# Altium schematic sheet demo_dermis_main_testboard_inamps.SchDoc
size A0
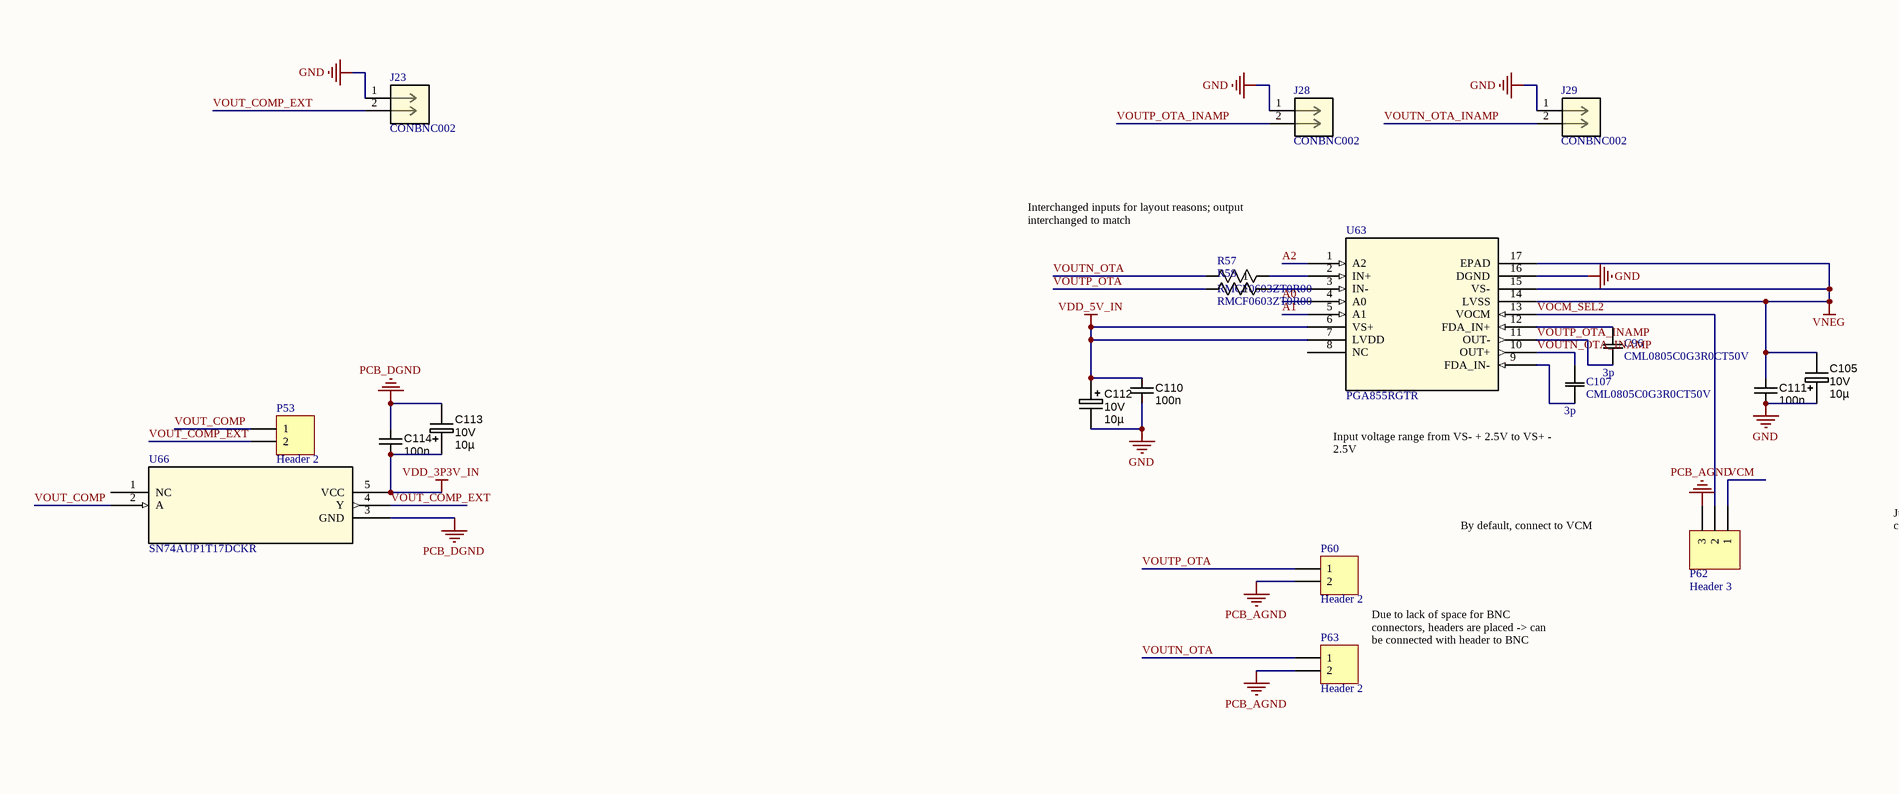
[diagram p0: demo_dermis_main_testboard_inamps.SchDoc, left]
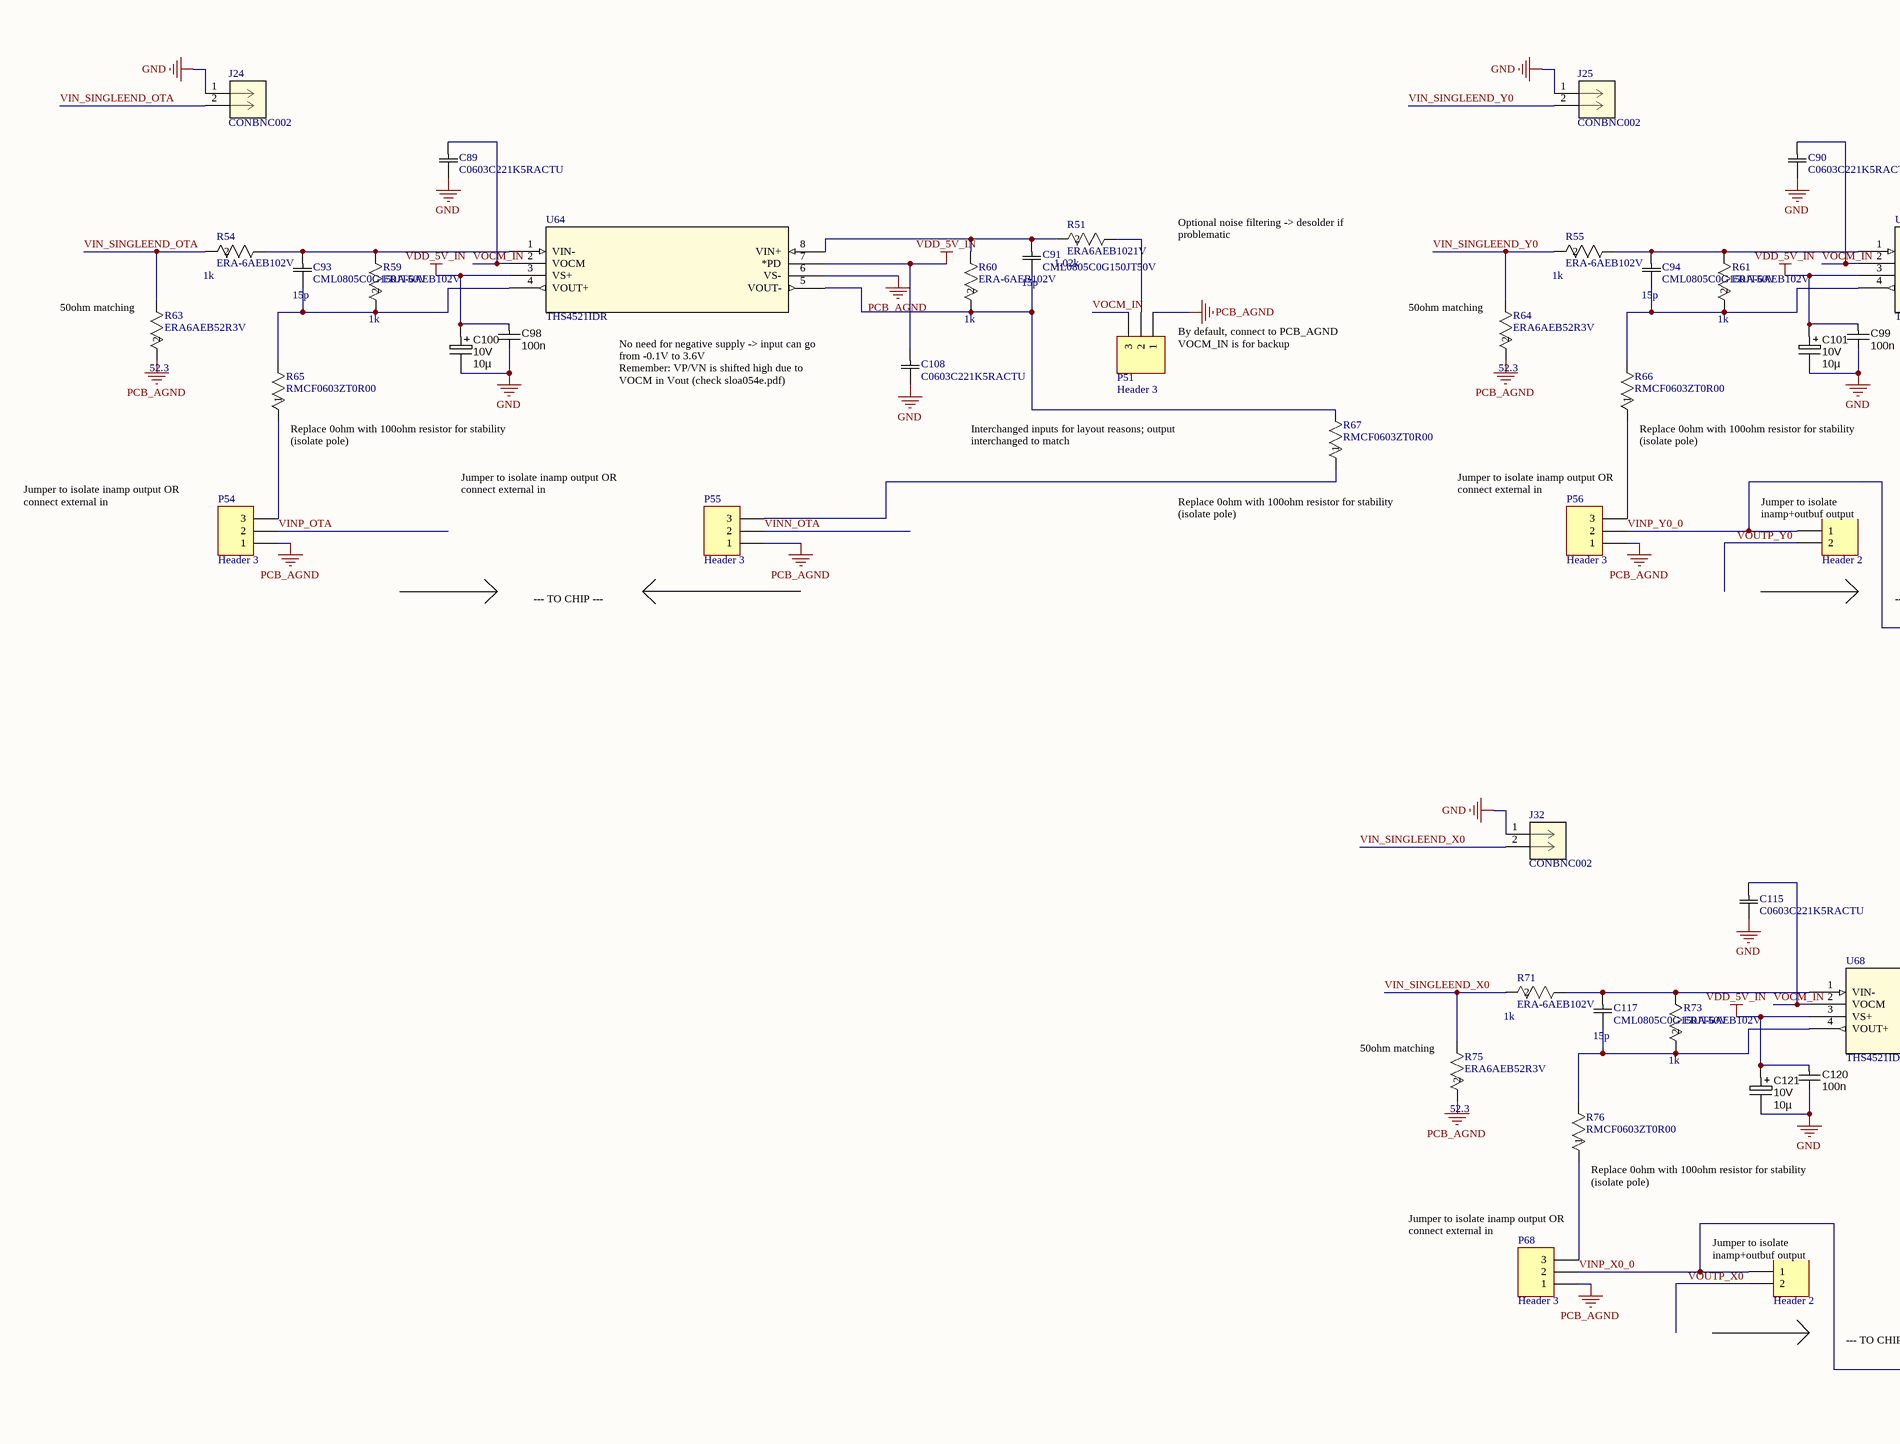
[diagram p1: demo_dermis_main_testboard_inamps.SchDoc, middle]
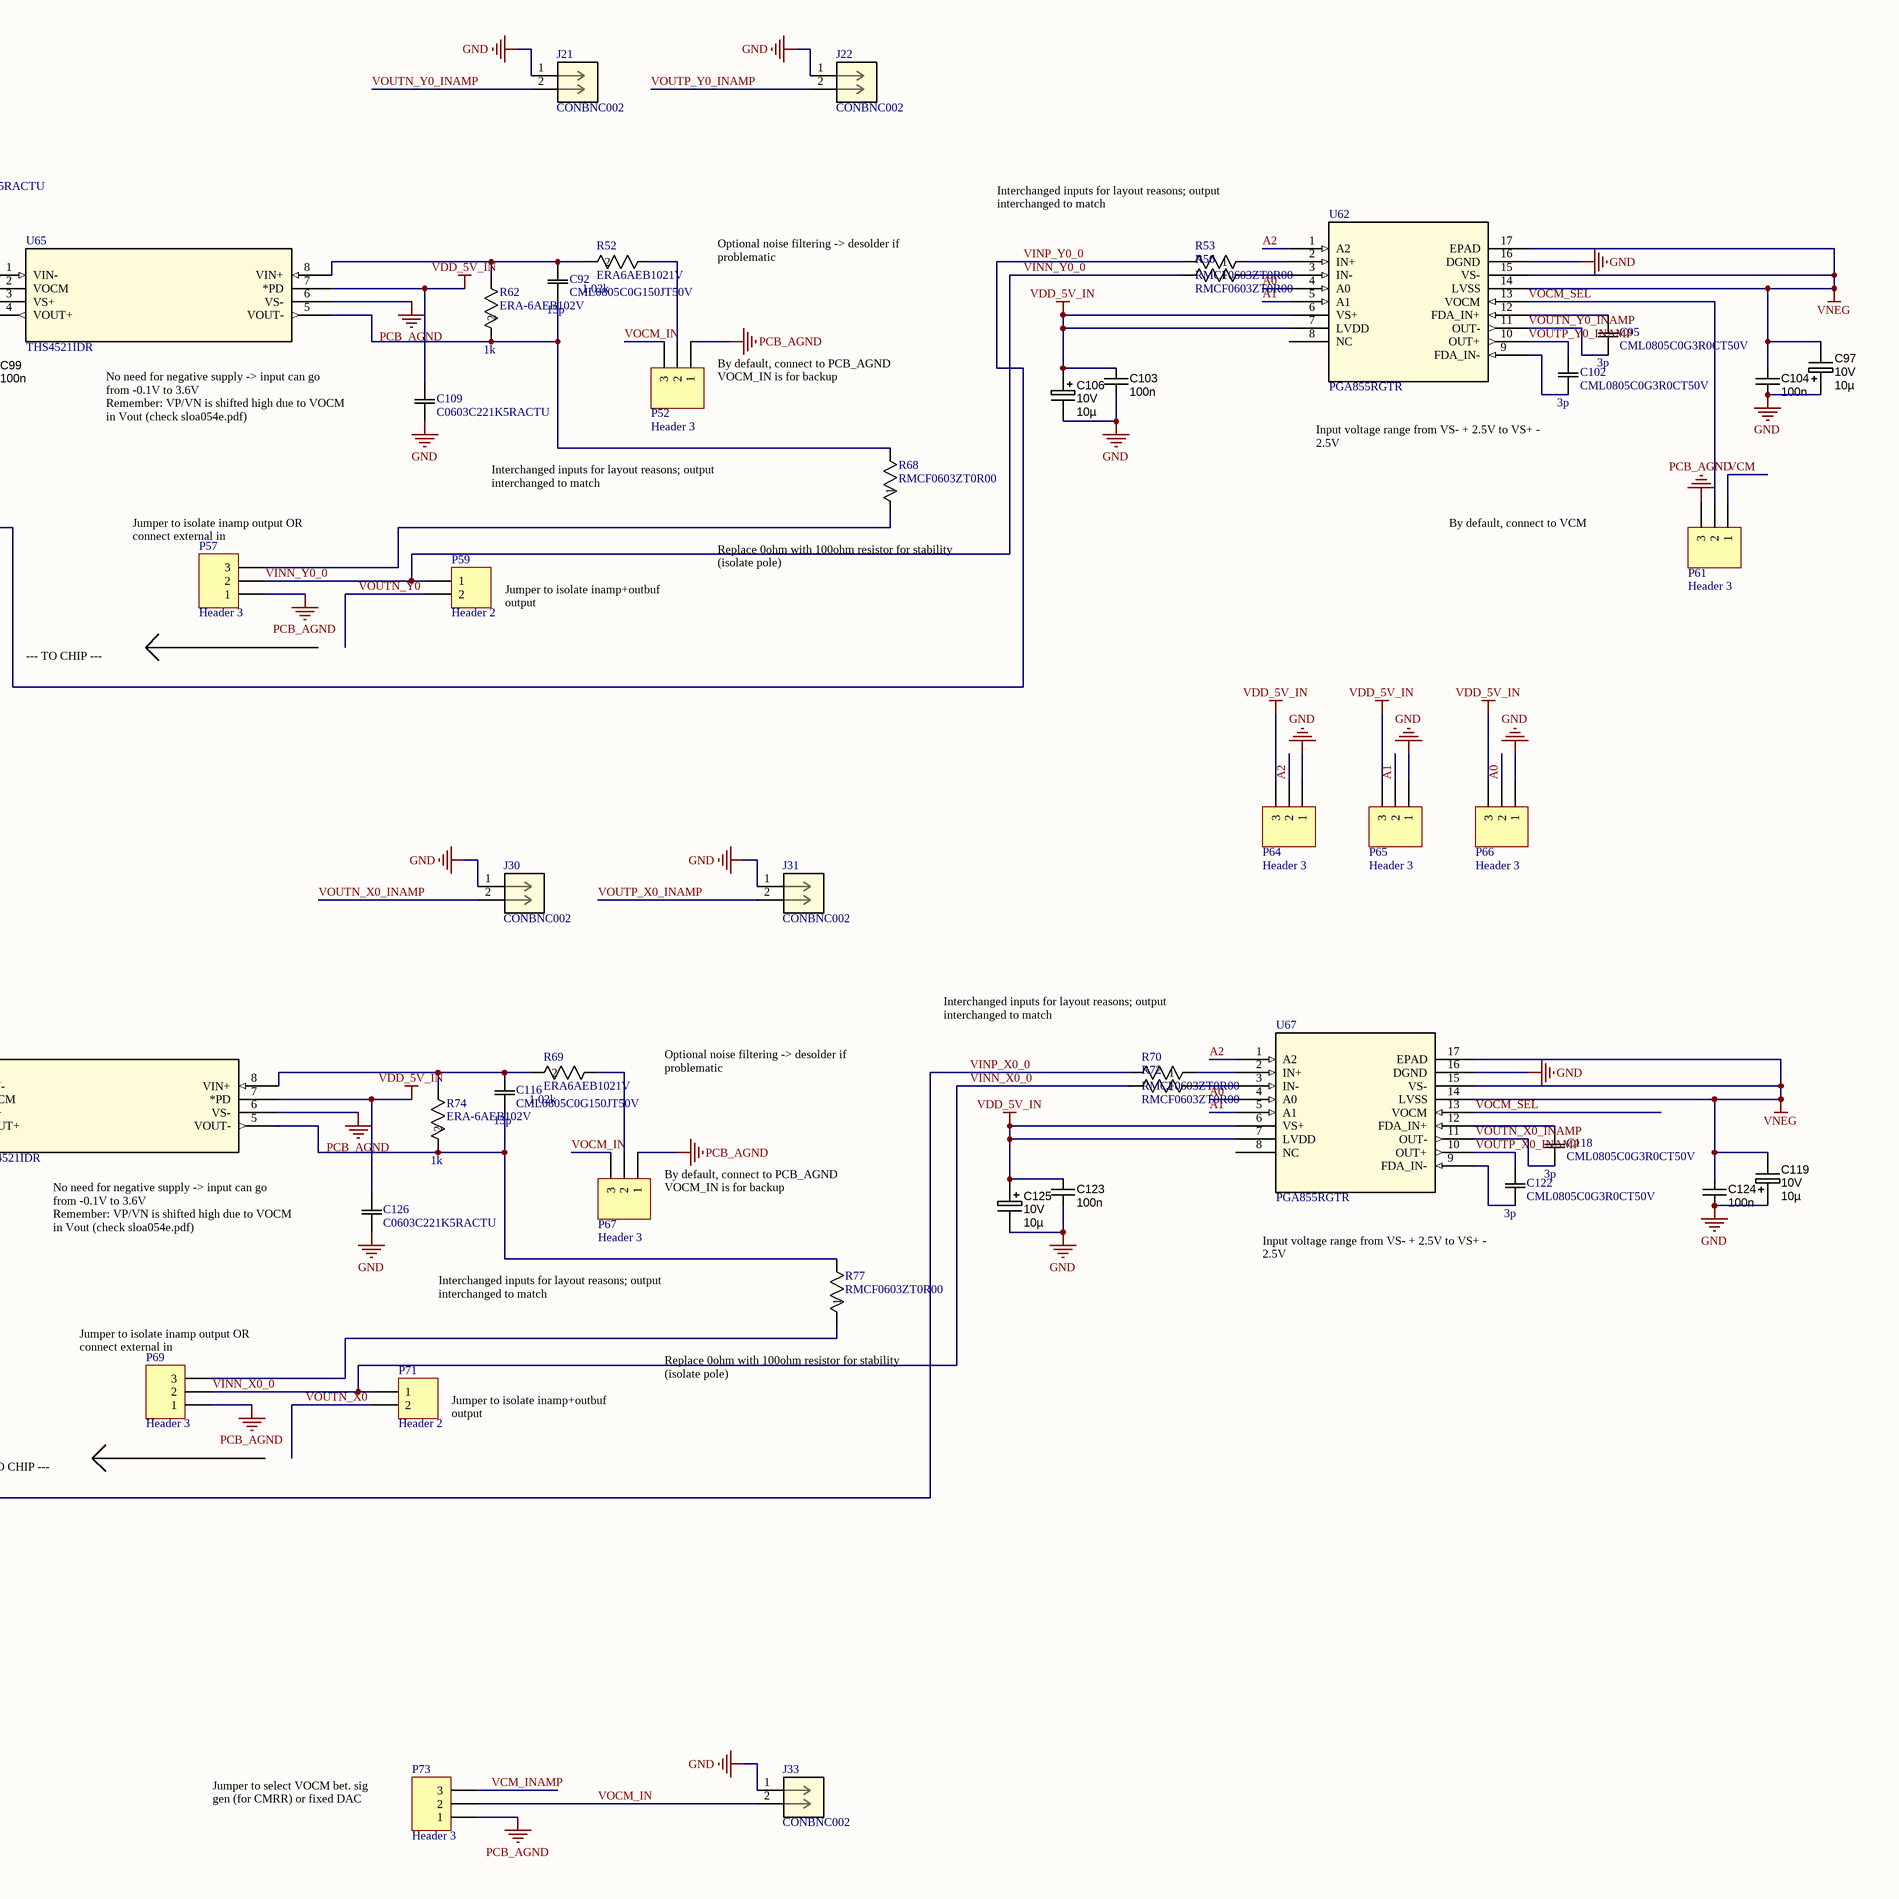
[diagram p2: demo_dermis_main_testboard_inamps.SchDoc, right]

## Parts
C89  C0603C221K5RACTU  [CAPC17595_87N_KEM]
C90  C0603C221K5RACTU  [CAPC17595_87N_KEM]
C91  CML0805C0G150JT50V  value 15p  [CAP_CML_0805_.3pF-1500pF,4700pF_STP]
C92  CML0805C0G150JT50V  value 15p  [CAP_CML_0805_.3pF-1500pF,4700pF_STP]
C93  CML0805C0G150JT50V  value 15p  [CAP_CML_0805_.3pF-1500pF,4700pF_STP]
C94  CML0805C0G150JT50V  value 15p  [CAP_CML_0805_.3pF-1500pF,4700pF_STP]
C95  CML0805C0G3R0CT50V  value 3p  [CAP_CML_0805_.3pF-1500pF,4700pF_STP]
C96  CML0805C0G3R0CT50V  value 3p  [CAP_CML_0805_.3pF-1500pF,4700pF_STP]
C97  Ratings: 10V  [CAPMP2012X150USR]  (hidden comment: 10µ)
C98  value 100n  [CAPC1608N]  (hidden comment: approved sub OK)
C99  value 100n  [CAPC1608N]  (hidden comment: approved sub OK)
C100  Ratings: 10V  [CAPMP2012X150USR]  (hidden comment: 10µ)
C101  Ratings: 10V  [CAPMP2012X150USR]  (hidden comment: 10µ)
C102  CML0805C0G3R0CT50V  value 3p  [CAP_CML_0805_.3pF-1500pF,4700pF_STP]
C103  value 100n  [CAPC1608N]  (hidden comment: approved sub OK)
C104  value 100n  [CAPC1608N]  (hidden comment: approved sub OK)
C105  Ratings: 10V  [CAPMP2012X150USR]  (hidden comment: 10µ)
C106  Ratings: 10V  [CAPMP2012X150USR]  (hidden comment: 10µ)
C107  CML0805C0G3R0CT50V  value 3p  [CAP_CML_0805_.3pF-1500pF,4700pF_STP]
C108  C0603C221K5RACTU  [CAPC17595_87N_KEM]
C109  C0603C221K5RACTU  [CAPC17595_87N_KEM]
C110  value 100n  [CAPC1608N]  (hidden comment: approved sub OK)
C111  value 100n  [CAPC1608N]  (hidden comment: approved sub OK)
C112  Ratings: 10V  [CAPMP2012X150USR]  (hidden comment: 10µ)
C113  Ratings: 10V  [CAPMP2012X150USR]  (hidden comment: 10µ)
C114  value 100n  [CAPC1608N]  (hidden comment: approved sub OK)
C115  C0603C221K5RACTU  [CAPC17595_87N_KEM]
C116  CML0805C0G150JT50V  value 15p  [CAP_CML_0805_.3pF-1500pF,4700pF_STP]
C117  CML0805C0G150JT50V  value 15p  [CAP_CML_0805_.3pF-1500pF,4700pF_STP]
C118  CML0805C0G3R0CT50V  value 3p  [CAP_CML_0805_.3pF-1500pF,4700pF_STP]
C119  Ratings: 10V  [CAPMP2012X150USR]  (hidden comment: 10µ)
C120  value 100n  [CAPC1608N]  (hidden comment: approved sub OK)
C121  Ratings: 10V  [CAPMP2012X150USR]  (hidden comment: 10µ)
C122  CML0805C0G3R0CT50V  value 3p  [CAP_CML_0805_.3pF-1500pF,4700pF_STP]
C123  value 100n  [CAPC1608N]  (hidden comment: approved sub OK)
C124  value 100n  [CAPC1608N]  (hidden comment: approved sub OK)
C125  Ratings: 10V  [CAPMP2012X150USR]  (hidden comment: 10µ)
C126  C0603C221K5RACTU  [CAPC17595_87N_KEM]
J21  CONBNC002  [CONN_CONBN_LNX]
J22  CONBNC002  [CONN_CONBN_LNX]
J23  CONBNC002  [CONN_CONBN_LNX]
J24  CONBNC002  [CONN_CONBN_LNX]
J25  CONBNC002  [CONN_CONBN_LNX]
J28  CONBNC002  [CONN_CONBN_LNX]
J29  CONBNC002  [CONN_CONBN_LNX]
J30  CONBNC002  [CONN_CONBN_LNX]
J31  CONBNC002  [CONN_CONBN_LNX]
J32  CONBNC002  [CONN_CONBN_LNX]
J33  CONBNC002  [CONN_CONBN_LNX]
P51  Header 3  [HDR1X3]
P52  Header 3  [HDR1X3]
P53  Header 2  [HDR1X2]
P54  Header 3  [HDR1X3]
P55  Header 3  [HDR1X3]
P56  Header 3  [HDR1X3]
P57  Header 3  [HDR1X3]
P58  Header 2  [HDR1X2]
P59  Header 2  [HDR1X2]
P60  Header 2  [HDR1X2]
P61  Header 3  [HDR1X3]
P62  Header 3  [HDR1X3]
P63  Header 2  [HDR1X2]
P64  Header 3  [HDR1X3]
P65  Header 3  [HDR1X3]
P66  Header 3  [HDR1X3]
P67  Header 3  [HDR1X3]
P68  Header 3  [HDR1X3]
P69  Header 3  [HDR1X3]
P70  Header 2  [HDR1X2]
P71  Header 2  [HDR1X2]
P73  Header 3  [HDR1X3]
R51  ERA6AEB1021V  value 1.02k  [RES_ERA6A_0805_PAN]
R52  ERA6AEB1021V  value 1.02k  [RES_ERA6A_0805_PAN]
R53  RMCF0603ZT0R00  [STA_RMCF0603_STP]
R54  ERA-6AEB102V  value 1k  [RC0805N_PAN]
R55  ERA-6AEB102V  value 1k  [RC0805N_PAN]
R56  RMCF0603ZT0R00  [STA_RMCF0603_STP]
R57  RMCF0603ZT0R00  [STA_RMCF0603_STP]
R58  RMCF0603ZT0R00  [STA_RMCF0603_STP]
R59  ERA-6AEB102V  value 1k  [RC0805N_PAN]
R60  ERA-6AEB102V  value 1k  [RC0805N_PAN]
R61  ERA-6AEB102V  value 1k  [RC0805N_PAN]
R62  ERA-6AEB102V  value 1k  [RC0805N_PAN]
R63  ERA6AEB52R3V  value 52.3  [RES_ERA6A_0805_PAN]
R64  ERA6AEB52R3V  value 52.3  [RES_ERA6A_0805_PAN]
R65  RMCF0603ZT0R00  [STA_RMCF0603_STP]
R66  RMCF0603ZT0R00  [STA_RMCF0603_STP]
R67  RMCF0603ZT0R00  [STA_RMCF0603_STP]
R68  RMCF0603ZT0R00  [STA_RMCF0603_STP]
R69  ERA6AEB1021V  value 1.02k  [RES_ERA6A_0805_PAN]
R70  RMCF0603ZT0R00  [STA_RMCF0603_STP]
R71  ERA-6AEB102V  value 1k  [RC0805N_PAN]
R72  RMCF0603ZT0R00  [STA_RMCF0603_STP]
R73  ERA-6AEB102V  value 1k  [RC0805N_PAN]
R74  ERA-6AEB102V  value 1k  [RC0805N_PAN]
R75  ERA6AEB52R3V  value 52.3  [RES_ERA6A_0805_PAN]
R76  RMCF0603ZT0R00  [STA_RMCF0603_STP]
R77  RMCF0603ZT0R00  [STA_RMCF0603_STP]
U62  PGA855RGTR  [VQFN16_RGT_TEX]
U63  PGA855RGTR  [VQFN16_RGT_TEX]
U64  THS4521IDR  [D8]
U65  THS4521IDR  [D8]
U66  SN74AUP1T17DCKR  [DCK5]
U67  PGA855RGTR  [VQFN16_RGT_TEX]
U68  THS4521IDR  [D8]

## Nets
GND: C89.2 C90.2 C97.1 C98.2 C99.2 C100.2 C101.2 C103.2 C104.1 C105.1 C106.2 C108.2 C109.2 C110.2 C111.1 C112.2 C115.2 C119.1 C120.2 C121.2 C123.2 C124.1 C125.2 C126.2 J21.1 J22.1 J23.1 J24.1 J25.1 J28.1 J29.1 J30.1 J31.1 J32.1 J33.1 P64.1 P65.1 P66.1 U62.16(DGND) U63.16(DGND) U67.16(DGND)
PCB_AGND: P51.1 P52.1 P54.1 P55.1 P56.1 P57.1 P60.2 P61.3 P62.3 P63.2 P67.1 P68.1 P69.1 P73.1 R63.2 R64.2 R75.2 U64.6(VS-) U65.6(VS-) U68.6(VS-)
PCB_DGND: C113.2 C114.2 U66.3(GND)
VDD_3P3V_IN: C113.1 C114.1 U66.5(VCC)
VDD_5V_IN: C98.1 C99.1 C100.1 C101.1 C103.1 C106.1 C108.1 C109.1 C110.1 C112.1 C120.1 C121.1 C123.1 C125.1 C126.1 P64.3 P65.3 P66.3 U62.6(VS+) U62.7(LVDD) U63.6(VS+) U63.7(LVDD) U64.3(VS+) U64.7(*PD) U65.3(VS+) U65.7(*PD) U67.6(VS+) U67.7(LVDD) U68.3(VS+) U68.7(*PD)
VNEG: C97.2 C104.2 C105.2 C111.2 C119.2 C124.2 U62.14(LVSS) U62.15(VS-) U62.17(EPAD) U63.14(LVSS) U63.15(VS-) U63.17(EPAD) U67.14(LVSS) U67.15(VS-) U67.17(EPAD)
A0: P66.2 U62.4(A0) U63.4(A0) U67.4(A0)
A1: P65.2 U62.5(A1) U63.5(A1) U67.5(A1)
A2: P64.2 U62.1(A2) U63.1(A2) U67.1(A2)
VCM: P61.1 P62.1
VCM_INAMP: P73.3
VIN_SINGLEEND_OTA: J24.2 R54.2 R63.1
VIN_SINGLEEND_X0: J32.2 R71.2 R75.1
VIN_SINGLEEND_Y0: J25.2 R55.2 R64.1
VINN_OTA: P55.2
VINN_X0_0: P69.2 P71.1 R72.2
VINN_Y0_0: P57.2 P59.1 R56.2
VINP_OTA: P54.2
VINP_X0_0: P68.2 P70.1 R70.2
VINP_Y0_0: P56.2 P58.1 R53.2
VOCM_IN: C89.1 C90.1 C115.1 J33.2 P51.3 P52.3 P67.3 P73.2 U64.2(VOCM) U65.2(VOCM) U68.2(VOCM)
VOCM_SEL: P61.2 U62.13(VOCM) U67.13(VOCM)
VOCM_SEL2: P62.2 U63.13(VOCM)
VOUT_COMP: P53.1 U66.2(A)
VOUT_COMP_EXT: J23.2 P53.2 U66.4(Y)
VOUTN_OTA: P63.1 R57.2
VOUTN_OTA_INAMP: C107.2 J29.2 U63.10(OUT+)
VOUTN_X0: P71.2
VOUTN_X0_INAMP: C118.1 J30.2 U67.11(OUT-)
VOUTN_Y0: P59.2
VOUTN_Y0_INAMP: C95.1 J21.2 U62.11(OUT-)
VOUTP_OTA: P60.1 R58.2
VOUTP_OTA_INAMP: C96.1 J28.2 U63.11(OUT-)
VOUTP_X0: P70.2
VOUTP_X0_INAMP: C122.2 J31.2 U67.10(OUT+)
VOUTP_Y0: P58.2
VOUTP_Y0_INAMP: C102.2 J22.2 U62.10(OUT+)
NetC91_1: C91.1 R51.2 R60.1 U64.8(VIN+)
NetC91_2: C91.2 R60.2 R67.2 U64.5(VOUT-)
NetC92_1: C92.1 R52.2 R62.1 U65.8(VIN+)
NetC92_2: C92.2 R62.2 R68.2 U65.5(VOUT-)
NetC93_1: C93.1 R54.1 R59.1 U64.1(VIN-)
NetC93_2: C93.2 R59.2 R65.2 U64.4(VOUT+)
NetC94_1: C94.1 R55.1 R61.1 U65.1(VIN-)
NetC94_2: C94.2 R61.2 R66.2 U65.4(VOUT+)
NetC95_2: C95.2 U62.12(FDA_IN+)
NetC96_2: C96.2 U63.12(FDA_IN+)
NetC102_1: C102.1 U62.9(FDA_IN-)
NetC107_1: C107.1 U63.9(FDA_IN-)
NetC116_1: C116.1 R69.2 R74.1 U68.8(VIN+)
NetC116_2: C116.2 R74.2 R77.2 U68.5(VOUT-)
NetC117_1: C117.1 R71.1 R73.1 U68.1(VIN-)
NetC117_2: C117.2 R73.2 R76.2 U68.4(VOUT+)
NetC118_2: C118.2 U67.12(FDA_IN+)
NetC122_1: C122.1 U67.9(FDA_IN-)
NetP51_2: P51.2 R51.1
NetP52_2: P52.2 R52.1
NetP54_3: P54.3 R65.1
NetP55_3: P55.3 R67.1
NetP56_3: P56.3 R66.1
NetP57_3: P57.3 R68.1
NetP67_2: P67.2 R69.1
NetP68_3: P68.3 R76.1
NetP69_3: P69.3 R77.1
NetR53_1: R53.1 U62.2(IN+)
NetR56_1: R56.1 U62.3(IN-)
NetR57_1: R57.1 U63.2(IN+)
NetR58_1: R58.1 U63.3(IN-)
NetR70_1: R70.1 U67.2(IN+)
NetR72_1: R72.1 U67.3(IN-)

Not connected (* = marked no-connect by the designer): U62 8(NC); U63 8(NC); U66 1(NC); U67 8(NC)

## Notes on the sheet
- Interchanged inputs for layout reasons; output interchanged to match
- Optional noise filtering -> desolder if problematic
- (near R63) 50ohm matching
- (near R64) 50ohm matching
- No need for negative supply -> input can go from -0.1V to 3.6V
  Remember: VP/VN is shifted high due to VOCM in Vout (check sloa054e.pdf)
- By default, connect to PCB_AGND
  VOCM_IN is for backup
- Input voltage range from VS- + 2.5V to VS+ - 2.5V
- (near R65) Replace 0ohm with 100ohm resistor for stability (isolate pole)
- Jumper to isolate inamp output OR connect external in
- (near P56) Jumper to isolate inamp output OR connect external in
- (near R66) Replace 0ohm with 100ohm resistor for stability (isolate pole)
- (near P57) Jumper to isolate inamp output OR connect external in
- By default, connect to VCM
- (near R67) Replace 0ohm with 100ohm resistor for stability (isolate pole)
- (near P58) Jumper to isolate inamp+outbuf output
- Jumper to isolate inamp+outbuf output
- (near R68) Replace 0ohm with 100ohm resistor for stability (isolate pole)
- Due to lack of space for BNC connectors, headers are placed -> can be connected with header to BNC
- --- TO CHIP ---
- (near R75) 50ohm matching
- (near R76) Replace 0ohm with 100ohm resistor for stability (isolate pole)
- (near P68) Jumper to isolate inamp output OR connect external in
- (near P70) Jumper to isolate inamp+outbuf output
- (near P69) Jumper to isolate inamp output OR connect external in
- (near R77) Replace 0ohm with 100ohm resistor for stability (isolate pole)
- Jumper to select VOCM bet. sig gen (for CMRR) or fixed DAC output (VCM)
- Title
- Size:
- Date:
- File:
- A0
- Number:
- Time:
- Revision:
- Sheet
- of

## Library data of the parts
C89 C90 C108 C109 C115 C126 = C0603C221K5RACTU: No Description Available; Mfr_Name: Kemet
C91-C94 C116 C117 = CML0805C0G150JT50V: No Description Available; Mfr_Name: Stackpole International
C95 C96 C102 C107 C118 C122 = CML0805C0G3R0CT50V: No Description Available; Mfr_Name: Stackpole International
C97 C100 C101 C105 C106 C112 C113 C119 C121 C125 = CAPT_10u_0805_10V: Capacitor SMD Tantalum 10uF 20% 10V 0805; Manufacturer 1: AVX Corporation; Manufacturer Part Number 1: TAJP106M010RNJ; Package / Case: 0805 (2012 metric); Tolerance: ±20%; Material: Tantalum; Supplier 1: Digi-Key; Supplier Part Number 1: 478-3281-1-ND; Value: 10µ
C98 C99 C103 C104 C110 C111 C114 C120 C123 C124 = CAPC_100n_0603: Capacitor SMD Cer 100nF 10% 50V X7R 0603; Manufacturer 1: AVX Corporation; Manufacturer Part Number 1: 06035C104KAT2A; Ratings: 50V; X7R; Material: ceramic; Manufacturer 2: TDK Corporation; Manufacturer Part Number 2: C1608X7R1H104K; Package / Case: 0603 (1608 Metric); Tolerance: ±10%; Supplier 1: Digi-Key; Supplier Part Number 1: 478-5052-1-ND; ComponentLink1URL: http://www.avx.com/docs/Catalogs/cx7r.pdf; ComponentLink1Description: http://www.avx.com/docs/Catalogs/cx7r.pdf; Supplier 2: Digi-Key; Supplier Part Number 2: 445-1314-1-ND; ComponentLink2URL: http://product.tdk.com/capacitor/mlcc/en/documents/mlcc_commercial_general_en.pdf; ComponentLink2Description: http://product.tdk.com/capacitor/mlcc/en/documents/mlcc_commercial_general_en.pdf
J21-J25 J28-J33 = CONBNC002: No Description Available; Mfr_Name: Linx Technologies; RefDes: RefDes; Type: Type
P51 P52 P54-P57 P61 P62 P64-P69 P73 = Header 3: Header, 3-Pin; LatestRevisionDate: 17-Jul-2002; LatestRevisionNote: Re-released for DXP Platform.; Publisher: Altium Limited
P53 P58-P60 P63 P70 P71 = Header 2: Header, 2-Pin; LatestRevisionDate: 17-Jul-2002; LatestRevisionNote: Re-released for DXP Platform.; Publisher: Altium Limited
R51 R52 R69 = ERA6AEB1021V: No Description Available; Mfr_Name: Panasonic
R53 R56-R58 R65-R68 R70 R72 R76 R77 = RMCF0603ZT0R00: No Description Available; Mfr_Name: Stackpole International
R54 R55 R59-R62 R71 R73 R74 = ERA-6AEB102V: No Description Available; Mfr_Name: Panasonic
R63 R64 R75 = ERA6AEB52R3V: No Description Available; Mfr_Name: Panasonic
U62 U63 U67 = PGA855RGTR: No Description Available; Mfr_Name: Texas Instruments; Type: Linear; RefDes: RefDes
U64 U65 U68 = THS4521IDR: No Description Available; Mfr_Name: Texas Instruments; RefDes: RefDes; Type: Type
U66 = SN74AUP1T17DCKR: No Description Available; Mfr_Name: Texas Instruments; RefDes: RefDes; Type: Type